# EAGLE design stm32-easy64 (EAGLE 5.11)

## Sheet 1 of 2
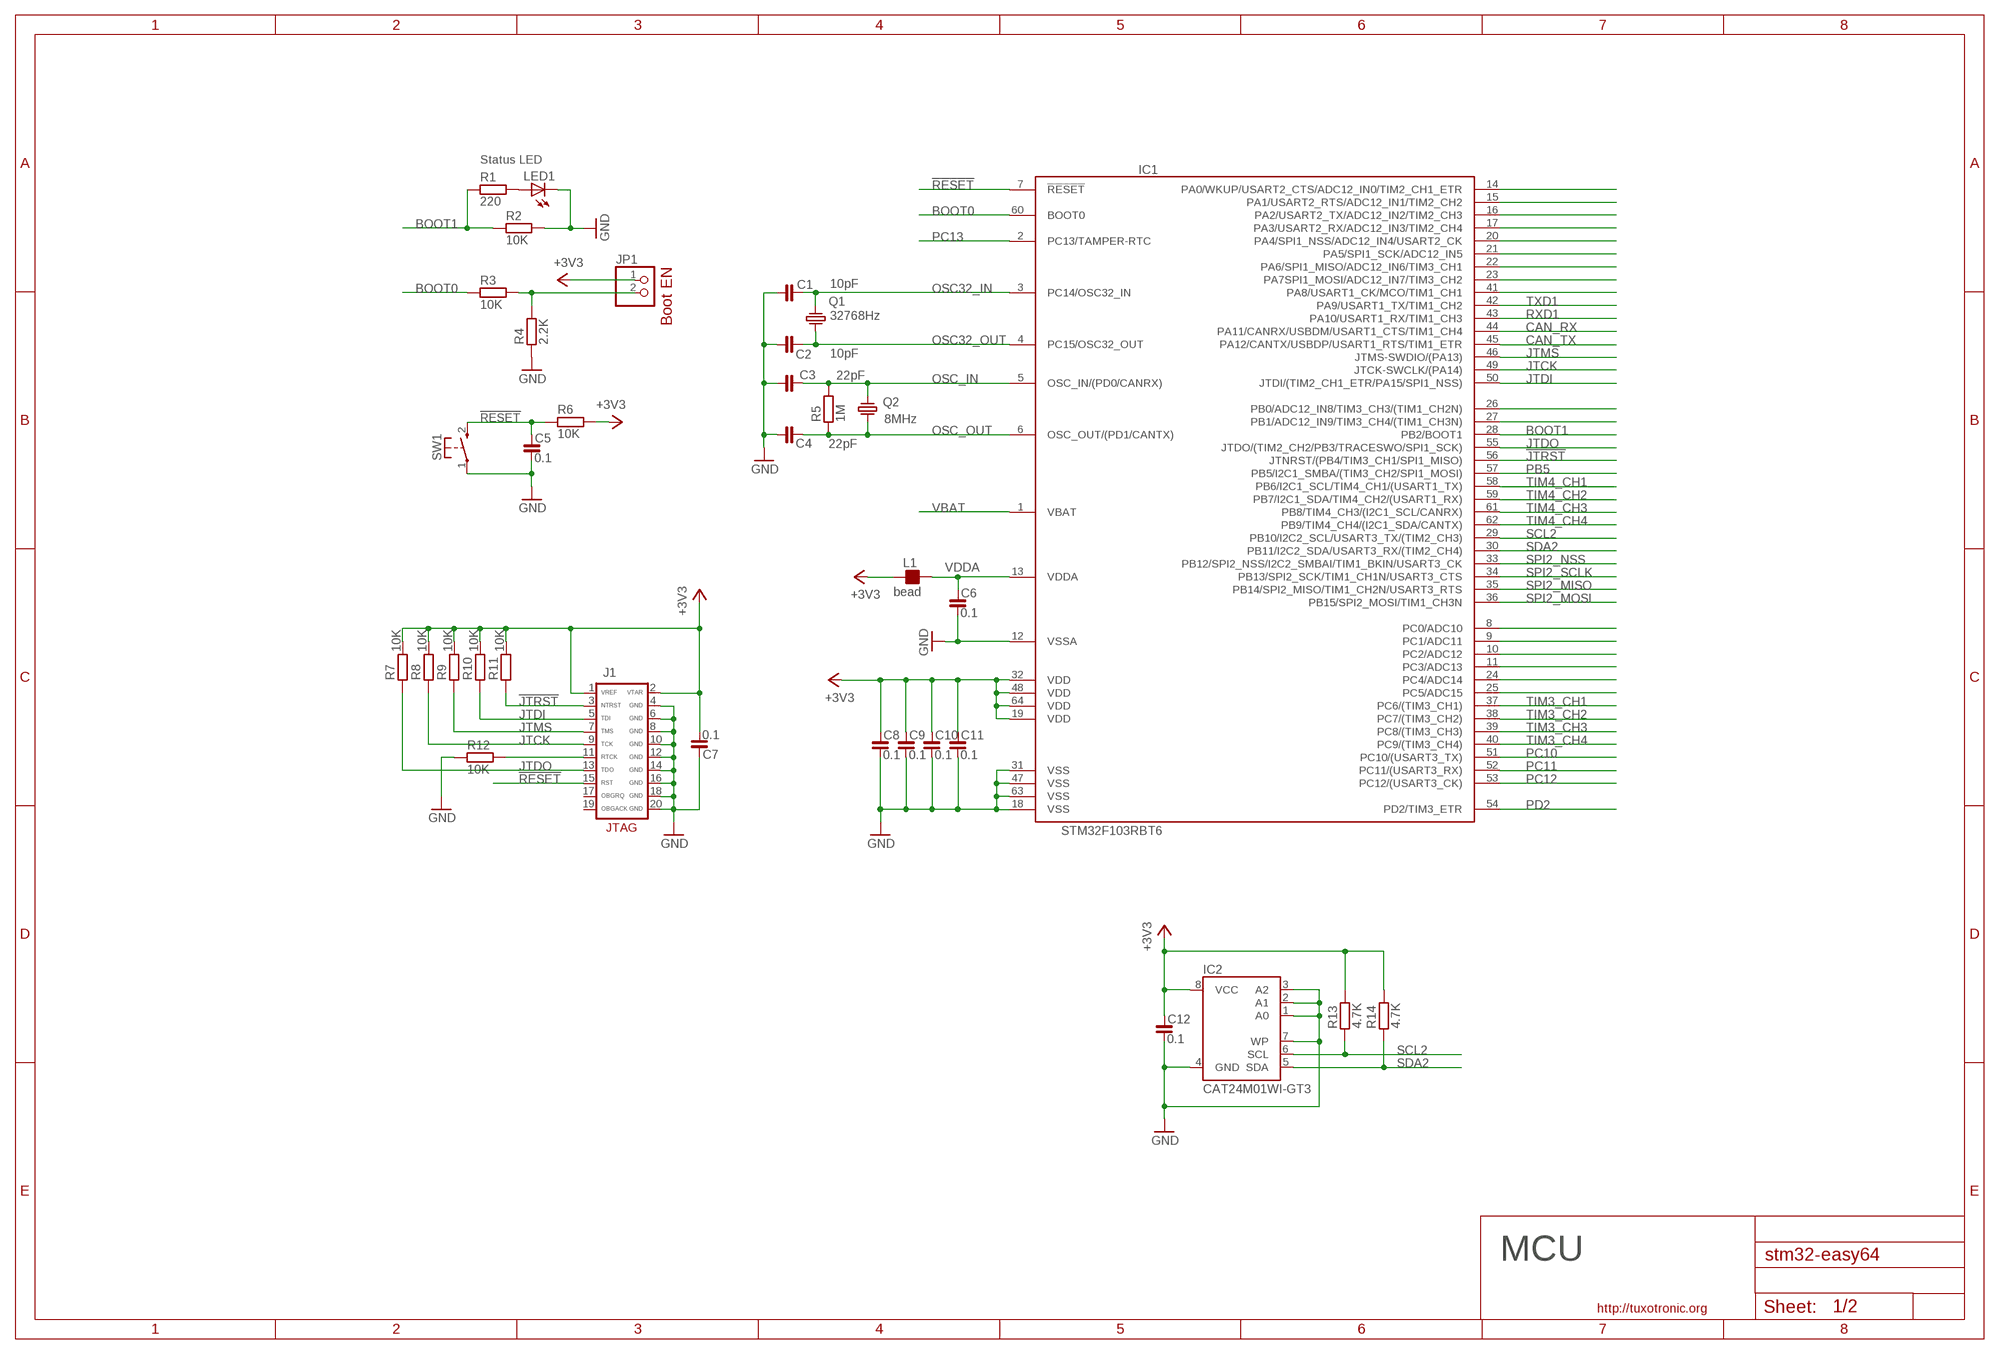
[diagram p0: schematic, sheet 1]

### Parts
C1  10pF  C_0603  [C0603]
C2  10pF  C_0603  [C0603]
C3  22pF  C_0603  [C0603]
C4  22pF  C_0603  [C0603]
C5  0.1  C_0603  [C0603]
C6  0.1  C_0603  [C0603]
C7  0.1  C_0603  [C0603]
C8  0.1  C_0603  [C0603]
C9  0.1  C_0603  [C0603]
C10  0.1  C_0603  [C0603]
C11  0.1  C_0603  [C0603]
C12  0.1  C_0603  [C0603]
IC1  STM32F103RBT6  STM32F103R  [TQFP64]
IC2  CAT24M01WI-GT3  AT24C256S  [SO08]
J1  JTAG-ARM-HDR2MM  [2X10M]
JP1  PINHD-1X2_2.00  [1X02M]
L1  bead  FB_0603  [L0603]
LED1  LEDCHIP-LED0805  [CHIP-LED0805]
Q1  32768Hz  CRYSTAL-TC26H  [TC26H]
Q2  8MHz  CRYSTAL-HC49S  [HC49/S]
R1  220  R_0603  [R0603]
R2  10K  R_0603  [R0603]
R3  10K  R_0603  [R0603]
R4  2.2K  R_0603  [R0603]
R5  1M  R_0603  [R0603]
R6  10K  R_0603  [R0603]
R7  10K  R_0603  [R0603]
R8  10K  R_0603  [R0603]
R9  10K  R_0603  [R0603]
R10  10K  R_0603  [R0603]
R11  10K  R_0603  [R0603]
R12  10K  R_0603  [R0603]
R13  4.7K  R_0603  [R0603]
R14  4.7K  R_0603  [R0603]
SW1  KSS-2EG4430  [KSS-2EG4430]

### Nets
!JTRST: IC1.56(JTNRST/(PB4/TIM3_CH1/SPI1_MISO)) J1.3(NTRST) R11.1
!RESET: C5.1 IC1.7(!RESET) J1.15(RST) R6.1 SW1.2(S)
+3V3: C7.2 C8.1 C9.1 C10.1 C11.1 C12.1 IC1.19(VDD) IC1.32(VDD) IC1.48(VDD) IC1.64(VDD) IC2.8(VCC) J1.1(VREF) J1.2(VTAR) JP1.1 L1.1 R6.2 R7.2 R8.2 R9.2 R10.2 R11.2 R13.2 R14.2 ; also sheet 2
BOOT0: IC1.60(BOOT0) R3.1
BOOT1: IC1.28(PB2/BOOT1) R1.1 R2.1
CAN_RX: IC1.44(PA11/CANRX/USBDM/USART1_CTS/TIM1_CH4) ; also sheet 2
CAN_TX: IC1.45(PA12/CANTX/USBDP/USART1_RTS/TIM1_ETR) ; also sheet 2
GND: C1.2 C2.2 C3.2 C4.2 C5.2 C6.2 C7.1 C8.2 C9.2 C10.2 C11.2 C12.2 IC1.12(VSSA) IC1.18(VSS) IC1.31(VSS) IC1.47(VSS) IC1.63(VSS) IC2.1(A0) IC2.2(A1) IC2.3(A2) IC2.4(GND) IC2.7(WP) J1.4(GND) J1.6(GND) J1.8(GND) J1.10(GND) J1.12(GND) J1.14(GND) J1.16(GND) J1.18(GND) J1.20(GND) LED1.C R2.2 R4.1 R12.1 SW1.1(P) ; also sheet 2
JTCK: IC1.49(JTCK-SWCLK/(PA14)) J1.9(TCK) R8.1
JTDI: IC1.50(JTDI/(TIM2_CH1_ETR/PA15/SPI1_NSS)) J1.5(TDI) R10.1
JTDO: IC1.55(JTDO/(TIM2_CH2/PB3/TRACESWO/SPI1_SCK)) J1.13(TDO) R7.1
JTMS: IC1.46(JTMS-SWDIO/(PA13)) J1.7(TMS) R9.1
N$3: JP1.2 R3.2 R4.2
N$6: J1.11(RTCK) R12.2
N$11: IC1.14(PA0/WKUP/USART2_CTS/ADC12_IN0/TIM2_CH1_ETR)
N$12: IC1.15(PA1/USART2_RTS/ADC12_IN1/TIM2_CH2)
N$13: IC1.16(PA2/USART2_TX/ADC12_IN2/TIM2_CH3)
N$14: IC1.17(PA3/USART2_RX/ADC12_IN3/TIM2_CH4)
N$15: IC1.20(PA4/SPI1_NSS/ADC12_IN4/USART2_CK)
N$16: IC1.21(PA5/SPI1_SCK/ADC12_IN5)
N$17: IC1.22(PA6/SPI1_MISO/ADC12_IN6/TIM3_CH1)
N$18: IC1.23(PA7SPI1_MOSI/ADC12_IN7/TIM3_CH2)
N$19: IC1.41(PA8/USART1_CK/MCO/TIM1_CH1)
N$24: IC1.26(PB0/ADC12_IN8/TIM3_CH3/(TIM1_CH2N))
N$25: IC1.27(PB1/ADC12_IN9/TIM3_CH4/(TIM1_CH3N))
N$30: LED1.A R1.2
N$40: IC1.25(PC5/ADC15)
N$41: IC1.24(PC4/ADC14)
N$42: IC1.11(PC3/ADC13)
N$43: IC1.10(PC2/ADC12)
N$44: IC1.9(PC1/ADC11)
N$45: IC1.8(PC0/ADC10)
OSC32_IN: C1.1 IC1.3(PC14/OSC32_IN) Q1.2
OSC32_OUT: C2.1 IC1.4(PC15/OSC32_OUT) Q1.1
OSC_IN: C3.1 IC1.5(OSC_IN/(PD0/CANRX)) Q2.1 R5.2
OSC_OUT: C4.1 IC1.6(OSC_OUT/(PD1/CANTX)) Q2.2 R5.1
PB5: IC1.57(PB5/I2C1_SMBA/(TIM3_CH2/SPI1_MOSI)) ; also sheet 2
PC10: IC1.51(PC10/(USART3_TX)) ; also sheet 2
PC11: IC1.52(PC11/(USART3_RX)) ; also sheet 2
PC12: IC1.53(PC12/(USART3_CK)) ; also sheet 2
PC13: IC1.2(PC13/TAMPER-RTC)
PD2: IC1.54(PD2/TIM3_ETR) ; also sheet 2
RXD1: IC1.43(PA10/USART1_RX/TIM1_CH3)
SCL2: IC1.29(PB10/I2C2_SCL/USART3_TX/(TIM2_CH3)) IC2.6(SCL) R13.1
SDA2: IC1.30(PB11/I2C2_SDA/USART3_RX/(TIM2_CH4)) IC2.5(SDA) R14.1
SPI2_MISO: IC1.35(PB14/SPI2_MISO/TIM1_CH2N/USART3_RTS)
SPI2_MOSI: IC1.36(PB15/SPI2_MOSI/TIM1_CH3N)
SPI2_NSS: IC1.33(PB12/SPI2_NSS/I2C2_SMBAI/TIM1_BKIN/USART3_CK)
SPI2_SCLK: IC1.34(PB13/SPI2_SCK/TIM1_CH1N/USART3_CTS)
TIM3_CH1: IC1.37(PC6/(TIM3_CH1)) ; also sheet 2
TIM3_CH2: IC1.38(PC7/(TIM3_CH2)) ; also sheet 2
TIM3_CH3: IC1.39(PC8/(TIM3_CH3)) ; also sheet 2
TIM3_CH4: IC1.40(PC9/(TIM3_CH4)) ; also sheet 2
TIM4_CH1: IC1.58(PB6/I2C1_SCL/TIM4_CH1/(USART1_TX)) ; also sheet 2
TIM4_CH2: IC1.59(PB7/I2C1_SDA/TIM4_CH2/(USART1_RX)) ; also sheet 2
TIM4_CH3: IC1.61(PB8/TIM4_CH3/(I2C1_SCL/CANRX)) ; also sheet 2
TIM4_CH4: IC1.62(PB9/TIM4_CH4/(I2C1_SDA/CANTX)) ; also sheet 2
TXD1: IC1.42(PA9/USART1_TX/TIM1_CH2)
VBAT: IC1.1(VBAT)
VDDA: C6.1 IC1.13(VDDA) L1.2
Unconnected: J1.17(OBGRQ) J1.19(OBGACK)

### Notes on the sheet
- Status LED
- Boot EN
- MCU

## Sheet 2 of 2
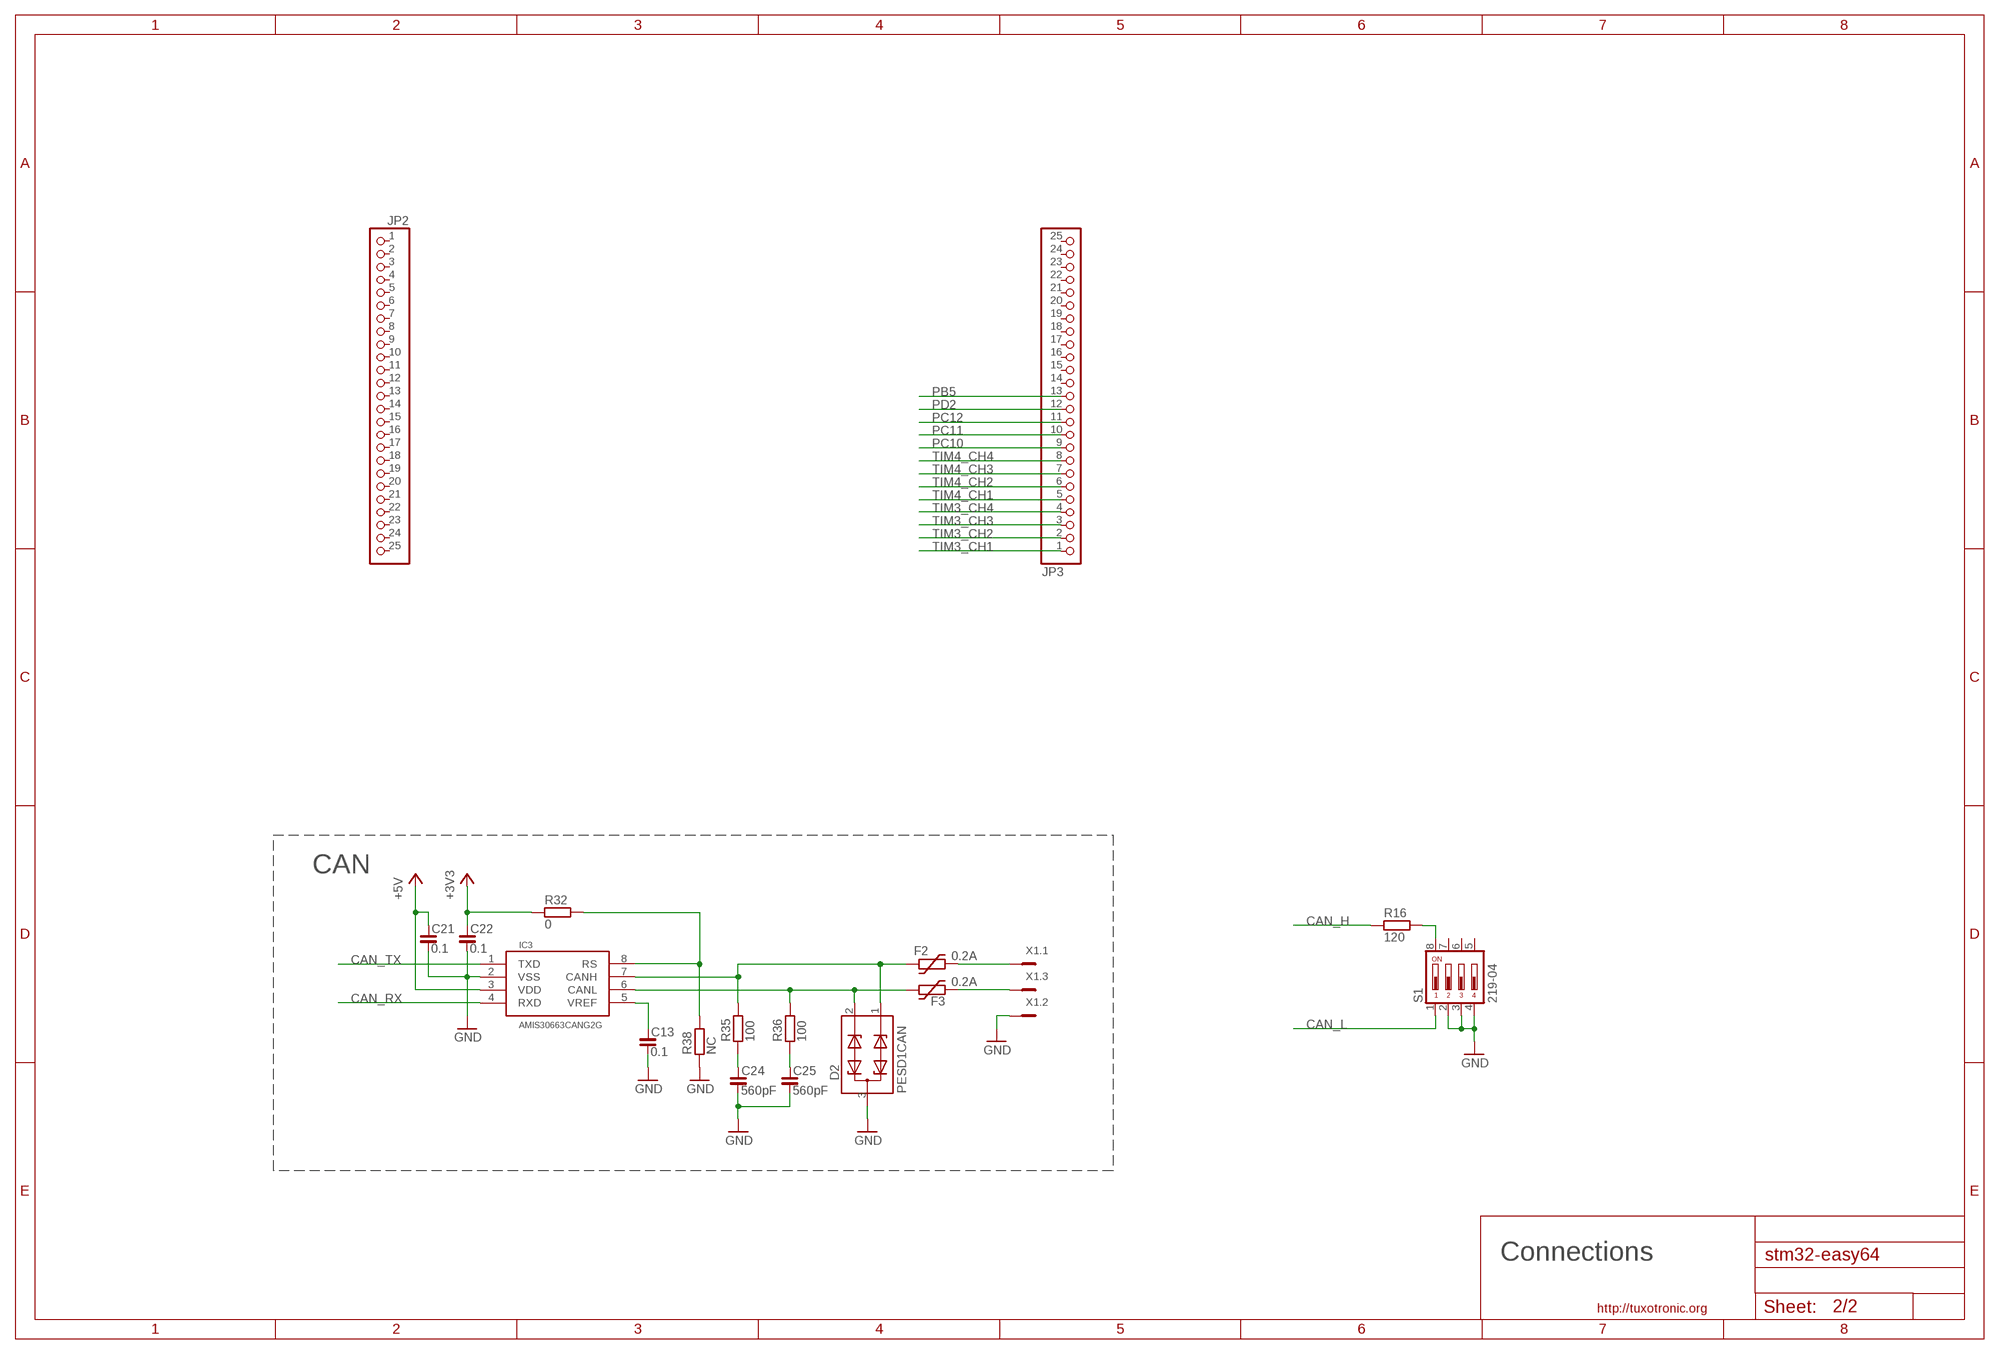
[diagram p1: schematic, sheet 2]

### Parts
C13  0.1  C_0603  [C0603]
C21  0.1  C_0603  [C0603]
C22  0.1  C_0603  [C0603]
C24  560pF  C_0603  [C0603]
C25  560pF  C_0603  [C0603]
D2  PESD1CAN  [SOT23]
F2  0.2A  1812L  [1812L]
F3  0.2A  1812L  [1812L]
IC3  AMIS30663CANG2G  SN65HVD230  [SO08]
JP2  PINHD-1X25_2.00  [1X25M]
JP3  PINHD-1X25_2.00  [1X25M]
R16  120  R_0805  [R0805]
R32  0  R_0603  [R0603]
R35  100  R_0603  [R0603]
R36  100  R_0603  [R0603]
R38  NC  R_0603  [R0603]
S1  219-04  [CTS-219-04]
X1  MCV3  [MCV3]

### Nets
+3V3: C22.1 R32.1 ; also sheet 1
+5V: C21.1 IC3.3(VDD)
CAN_CTRL: IC3.8(RS) R32.2 R38.2
CAN_H: F2.P$2 R16.1 X1.1
CAN_L: F3.P$2 S1.1 X1.3
CAN_RX: IC3.4(RXD) ; also sheet 1
CAN_TX: IC3.1(TXD) ; also sheet 1
GND: C13.2 C21.2 C22.2 C24.2 C25.2 D2.3 IC3.2(VSS) R38.1 S1.2 S1.3 S1.4 X1.2 ; also sheet 1
N$1: C13.1 IC3.5(VREF)
N$2: R16.2 S1.8
N$51: D2.1 F2.P$1 IC3.7(CANH) R35.2
N$52: D2.2 F3.P$1 IC3.6(CANL) R36.2
N$54: C25.1 R36.1
N$55: C24.1 R35.1
PB5: JP3.13 ; also sheet 1
PC10: JP3.9 ; also sheet 1
PC11: JP3.10 ; also sheet 1
PC12: JP3.11 ; also sheet 1
PD2: JP3.12 ; also sheet 1
TIM3_CH1: JP3.1 ; also sheet 1
TIM3_CH2: JP3.2 ; also sheet 1
TIM3_CH3: JP3.3 ; also sheet 1
TIM3_CH4: JP3.4 ; also sheet 1
TIM4_CH1: JP3.5 ; also sheet 1
TIM4_CH2: JP3.6 ; also sheet 1
TIM4_CH3: JP3.7 ; also sheet 1
TIM4_CH4: JP3.8 ; also sheet 1
Unconnected: JP2.1 JP2.2 JP2.3 JP2.4 JP2.5 JP2.6 JP2.7 JP2.8 JP2.9 JP2.10 JP2.11 JP2.12 JP2.13 JP2.14 JP2.15 JP2.16 JP2.17 JP2.18 JP2.19 JP2.20 JP2.21 JP2.22 JP2.23 JP2.24 JP2.25 JP3.14 JP3.15 JP3.16 JP3.17 JP3.18 JP3.19 JP3.20 JP3.21 JP3.22 JP3.23 JP3.24 JP3.25 S1.5 S1.6 S1.7

### Notes on the sheet
- CAN
- Connections

## Library data of the parts
C1-C13 C21 C22 C24 C25 = rc-master-smd:C_: NON-POLARIZED CAP
D2 = protect:PESD1CAN: Features Due to the integrated diode structure only one small SOT23 package is needed to protect two CAN bus lines Max. peak pulse power: PPP = 200 W at tp = 8/20 ?s Low clamping voltage: VCL = 40 V at IPP = 1 A Ultra low leakage current: IRM < 1 nA ESD protection up to 23 kV IEC 61000-4-2, level 4 (ESD) IEC 61000-4-5 (surge); IPP = 3 A at tp = 8/20 ?s Small SMD plastic package Applications CAN bus protection Automotive applications
F2 F3 = discrete:1812L
IC1 = stm32:STM32F103R: Medium-density performance line ARM-based 32-bit MCU with 64 or 128 KB Flash, USB, CAN, 7 timers, 2 ADCs, 9 communication interfaces
IC2 = stm32-by-pb:AT24C*: 2-wire serial EEPROM
IC3 = interfaces:SN65HVD230: CAN PHY driver
J1 = atmel-arm:JTAG-ARM-: JTAG Programming/Debug Connector
JP1 = pinhead-fixdrills:PINHD-1X2: PIN HEADER
JP2 JP3 = pinhead-fixdrills:PINHD-1X25: PIN HEADER
L1 = rc-master-smd:FB_: FERRITE BEAD
LED1 = led:LED: LED OSRAM: - CHIPLED LG R971, LG N971, LY N971, LG Q971, LY Q971, LO R971, LY R971 LH N974, LH R974 LS Q976, LO Q976, LY Q976 LO Q996 - Hyper CHIPLED LW Q18S LB Q993, LB Q99A, LB R99A - SideLED LS A670, LO A670, LY A670, LG A670, LP A670 LB A673, LV A673, LT A673, LW A673 LH A674 LY A675 LS A676, LA A676, LO A676, LY A676, LW A676 LS A679, LY A679, LG A679 - Hyper Micro SIDELED® LS Y876, LA Y876, LO Y876, LY Y876 LT Y87S - SmartLED LW L88C, LW L88S LB L89C, LB L89S, LG L890 LS L89K, LO L89K, LY L89K LS L896, LA L896, LO L896, LY L896 - TOPLED LS T670, LO T670, LY T670, LG T670, LP T670 LSG T670, LSP T670, LSY T670, LOP T670, LYG T670 LG T671, LOG T671, LSG T671 LB T673, LV T673, LT T673, LW T673 LH T674 LS T676, LA T676, LO T676, LY T676, LB T676, LH T676, LSB T676, LW T676 LB T67C, LV T67C, LT T67C, LS T67K, LO T67K, LY T67K, LW E67C LS E67B, LA E67B, LO E67B, LY E67B, LB E67C, LV E67C, LT E67C LW T67C LS T679, LY T679, LG T679 LS T770, LO T770, LY T770, LG T770, LP T770 LB T773, LV T773, LT T773, LW T773 LH T774 LS E675, LA E675, LY E675, LS T675 LS T776, LA T776, LO T776, LY T776, LB T776 LHGB T686 LT T68C, LB T68C - Hyper Mini TOPLED® LB M676 - Mini TOPLED Santana® LG M470 LS M47K, LO M47K, LY M47K Source: http://www.osram.convergy.de - LUMILED® LXK2-PW12-R00, LXK2-PW12-S00, LXK2-PW14-U00, LXK2-PW14-V00 LXK2-PM12-R00, LXK2-PM12-S00, LXK2-PM14-U00 LXK2-PE12-Q00, LXK2-PE12-R00, LXK2-PE12-S00, LXK2-PE14-T00, LXK2-PE14-U00 LXK2-PB12-K00, LXK2-PB12-L00, LXK2-PB12-M00, LXK2-PB14-N00, LXK2-PB14-P00, LXK2-PB14-Q00 LXK2-PR12-L00, LXK2-PR12-M00, LXK2-PR14-Q00, LXK2-PR14-R00 LXK2-PD12-Q00, LXK2-PD12-R00, LXK2-PD12-S00 LXK2-PH12-R00, LXK2-PH12-S00 LXK2-PL12-P00, LXK2-PL12-Q00, LXK2-PL12-R00 Source: www.luxeon.com
Q1 Q2 = discrete:CRYSTAL-: CRYSTAL
R1-R14 R16 R32 R35 R36 R38 = rc-master-smd:R_: RESISTOR
S1 = switch-dil:219-04*: Surface Mount DIP Switch Series 219 SMT CTS Electronic Components Sourc: www.ctscorp.com
SW1 = buttons:KSS-2EG4430: Size: 3x6mm Height: 5mm from PCB Rating: DC12v 50mA Travel: 0.25±0.10mm Operating Force: 180±50gf Return Force: 60gf min Contact resistance: 100m? max Insulation resistance: 100M? min Operating life?50,000 cycles
X1 = con-phoenix-381_l:MCV3: Mini-Combicon 3.81mm vertikal 3polig (ohne Gegenstecker)

## Net classes
0 default: width 0.1 mm, drill 0.1 mm, clearance 0.1 mm

## Board
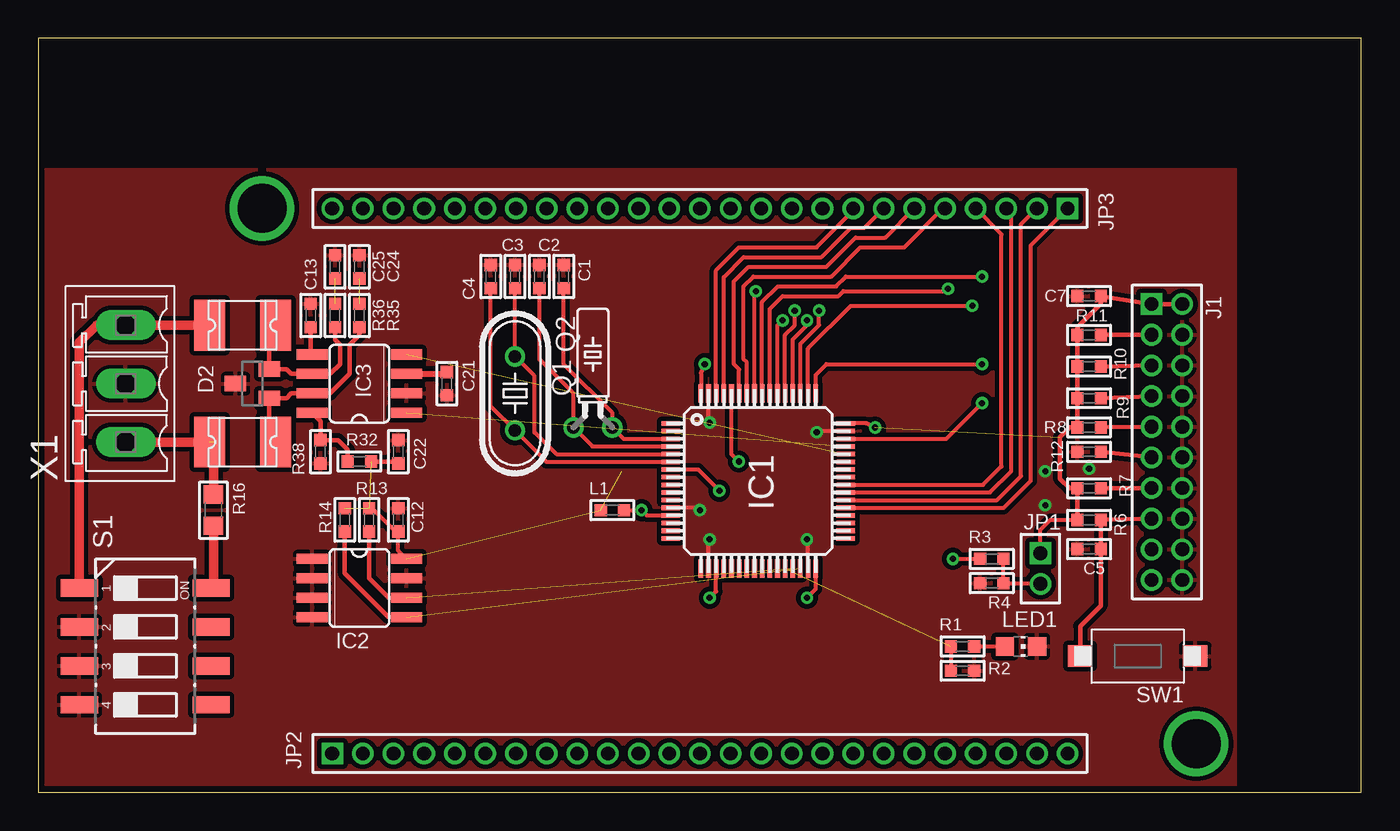
[diagram p2: board, top side]
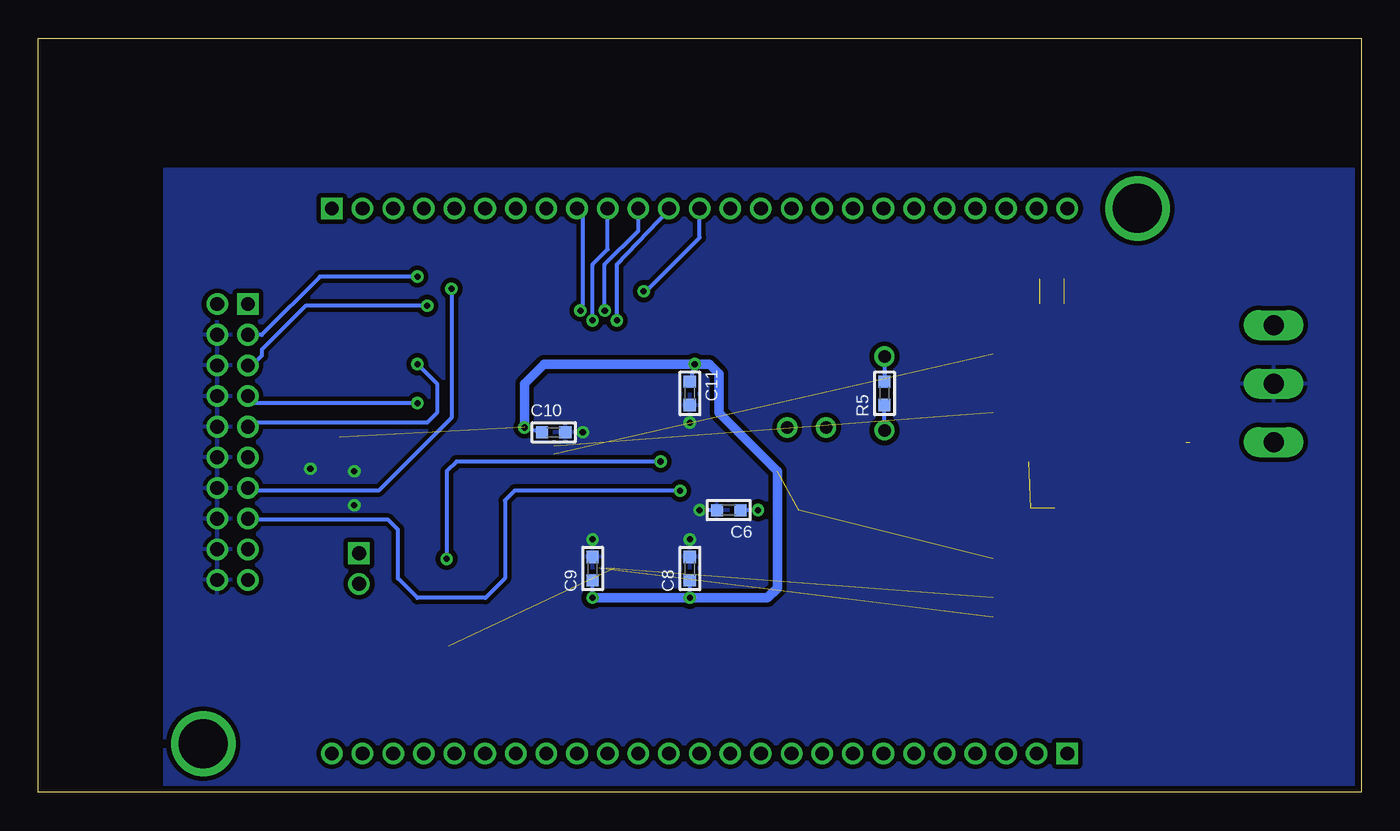
[diagram p3: board, bottom side, seen from below]

Size 86.34 x 49.2 mm. Coordinates in mm from the lower left corner, seen from the top.
Outline: 0,0 86.34,0 86.34,49.2 0,49.2 0,0
Copper layers (1*16): Top 0.035mm / dielectric 1.5mm / Bottom 0.035mm
Design rules "default *": minimum track width 0.16mm, minimum drill 0.4mm, track to track 0.16mm, track to pad 0.16mm, pad to pad 0.16mm, via to via 0.16mm, smd to smd 0.16mm, copper to edge 0.4mm, drill to drill 8mil, minimum pad ring 10mil, minimum via ring 8mil, stop-mask expansion 4mil, vias tented up to drill 0.6mm, thermal gap 10mil

### Footprints (pad centres in the part's own frame; a part is rotated, then mirrored left to right if it is on the bottom)
C0603 = smd 0.8 x 0.8: 1 -0.762,0; 2 0.762,0
SOT23 = smd 1 x 1.4: 1 -0.95,-1.1; 2 0.95,-1.1; 3 0,1.1
1812L = smd 2.03 x 3.3: P$1 -2.16,0; P$2 2.16,0
TQFP64 = smd 1.2 x 0.3: 1 -5.7,3.75; 2 -5.7,3.25; 3 -5.7,2.75; 4 -5.7,2.25; 5 -5.7,1.75; 6 -5.7,1.25; 7 -5.7,0.75; 8 -5.7,0.25; 9 -5.7,-0.25; 10 -5.7,-0.75; 11 -5.7,-1.25; 12 -5.7,-1.75; 13 -5.7,-2.25; 14 -5.7,-2.75; 15 -5.7,-3.25; 16 -5.7,-3.75; 33 5.7,-3.75; 34 5.7,-3.25; 35 5.7,-2.75; 36 5.7,-2.25; 37 5.7,-1.75; 38 5.7,-1.25; 39 5.7,-0.75; 40 5.7,-0.25; 41 5.7,0.25; 42 5.7,0.75; 43 5.7,1.25; 44 5.7,1.75; 45 5.7,2.25; 46 5.7,2.75; 47 5.7,3.25; 48 5.7,3.75 | smd 0.3 x 1.2: 17 -3.75,-5.7; 18 -3.25,-5.7; 19 -2.75,-5.7; 20 -2.25,-5.7; 21 -1.75,-5.7; 22 -1.25,-5.7; 23 -0.75,-5.7; 24 -0.25,-5.7; 25 0.25,-5.7; 26 0.75,-5.7; 27 1.25,-5.7; 28 1.75,-5.7; 29 2.25,-5.7; 30 2.75,-5.7; 31 3.25,-5.7; 32 3.75,-5.7; 49 3.75,5.7; 50 3.25,5.7; 51 2.75,5.7; 52 2.25,5.7; 53 1.75,5.7; 54 1.25,5.7; 55 0.75,5.7; 56 0.25,5.7; 57 -0.25,5.7; 58 -0.75,5.7; 59 -1.25,5.7; 60 -1.75,5.7; 61 -2.25,5.7; 62 -2.75,5.7; 63 -3.25,5.7; 64 -3.75,5.7
SO08 = smd 0.66 x 2.032: 1 -1.905,-3.073; 2 -0.635,-3.073; 3 0.635,-3.073; 4 1.905,-3.073; 5 1.905,3.073; 6 0.635,3.073; 7 -0.635,3.073; 8 -1.905,3.073
2X10M = drill 0.9 square: 1 -9,-1 | drill 0.9 round: 2 -9,1; 3 -7,-1; 4 -7,1; 5 -5,-1; 6 -5,1; 7 -3,-1; 8 -3,1; 9 -1,-1; 10 -1,1; 11 1,-1; 12 1,1; 13 3,-1; 14 3,1; 15 5,-1; 16 5,1; 17 7,-1; 18 7,1; 19 9,-1; 20 9,1
1X02M = drill 0.9 square: 1 -1,0 | drill 0.9 round: 2 1,0
1X25M = drill 0.9 square: 1 -24,0 | drill 0.9 round: 2 -22,0; 3 -20,0; 4 -18,0; 5 -16,0; 6 -14,0; 7 -12,0; 8 -10,0; 9 -8,0; 10 -6,0; 11 -4,0; 12 -2,0; 13 0,0; 14 2,0; 15 4,0; 16 6,0; 17 8,0; 18 10,0; 19 12,0; 20 14,0; 21 16,0; 22 18,0; 23 20,0; 24 22,0; 25 24,0
L0603 = smd 0.8 x 0.8: 1 -0.762,0; 2 0.762,0
CHIP-LED0805 = smd 1.2 x 1.2: A 0,-1.05; C 0,1.05
TC26H = drill 0.813 round: 1 -1.27,0; 2 1.27,0
HC49/S = drill 0.813 round: 1 -2.413,0; 2 2.413,0
R0603 = smd 0.8 x 0.8: 1 -0.762,0; 2 0.762,0
R0805 = smd 1.2 x 1.3: 1 -1.016,0; 2 1.016,0
CTS-219-04 = smd 1.13 x 2.44: 1 -3.81,-4.3; 2 -1.27,-4.3; 3 1.27,-4.3; 4 3.81,-4.3; 5 3.81,4.3; 6 1.27,4.3; 7 -1.27,4.3; 8 -3.81,4.3
KSS-2EG4430 = smd 1.6 x 1.4: 1 -3.75,0; 2 3.75,0
MCV3 = drill 1.3 pad 1.905 long: 1 -3.81,0; 2 0,0; 3 3.81,0

### Placement (x,y rotation side)
C1  34.29,33.66 90 top
C2  32.7,33.66 90 top
C3  31.11,33.66 90 top
C4  29.53,33.66 90 top
C5  68.58,15.88 180 top
C6  41.27,18.41 180 bottom
C7  68.58,32.38 0 top
C8  43.81,14.61 90 bottom
C9  50.16,14.61 90 bottom
C10  52.7,23.5 0 bottom
C11  43.81,26.04 270 bottom
C12  23.5,17.78 90 top
C13  17.78,31.11 90 top
C21  26.67,26.67 270 top
C22  23.5,22.23 90 top
C24  20.95,34.29 90 top
C25  19.37,34.29 90 top
D2  13.97,26.67 90 top
F2  13.34,22.86 180 top
F3  13.34,30.48 180 top
IC1  46.99,20.32 0 top
IC2  20.95,13.34 270 top
IC3  20.95,26.67 90 top
J1  73.66,22.86 270 top
JP1  65.41,14.61 270 top
JP2  43.18,2.54 0 top
JP3  43.18,38.1 180 top
L1  37.47,18.41 0 top
LED1  64.14,9.53 270 top
Q1  36.2,23.81 0 top
Q2  31.11,26.04 270 top
R1  60.33,9.53 0 top
R2  60.33,7.94 0 top
R3  62.23,15.24 0 top
R4  62.23,13.65 0 top
R5  31.11,26.04 90 bottom
R6  68.58,17.78 180 top
R7  68.58,19.84 180 top
R8  68.58,23.81 180 top
R9  68.58,25.72 180 top
R10  68.58,27.78 180 top
R11  68.58,29.84 180 top
R12  68.58,22.23 0 top
R13  21.59,17.78 90 top
R14  20,17.78 90 top
R16  11.43,18.41 270 top
R32  20.95,21.59 180 top
R35  20.95,31.11 270 top
R36  19.37,31.11 270 top
R38  18.41,22.23 90 top
S1  6.99,9.53 270 top
SW1  71.75,8.89 180 top
X1  5.71,26.67 90 top

### Tracks (layer width: path | path; a pad name or v marks a point on that pad's centre or on a via)
!JTRST  (via drill 0.4)
  Top 0.254: v61.59,33.66 52.7,33.66 52.07,33.02 48.26,33.02 47.24,32 IC1.56
  Top 0.305: J1.3 R11.1
  Bottom 0.254: v61.59,33.66 67.96,33.66 71.75,29.86 J1.3
!RESET  (via drill 0.4)
  Top 0.254: IC1.7 43.06,21.07 v44.45,19.68
  Top 0.305: J1.15 R6.1 C5.1 69.34,12.19 68,10.86 SW1.2
  Bottom 0.254: v44.45,19.68 55.24,19.68 55.88,19.05 55.88,13.97 57.15,12.7 61.59,12.7 62.87,13.97 62.87,17.14 63.5,17.78 72.58,17.78 J1.15
+3V3  (via drill 0.4)  (5 unrouted)
  Top 0.254: IC1.64 43.24,27.36 v43.5,27.94 | IC1.19 44.24,13.12 v43.81,12.7 | IC1.32 50.74,13.28 v50.16,12.7 | IC1.48 54.03,24.07 v54.61,23.81 | R13.2 21.78,18.54 23.3,17.02 C12.1 23.5,15.77 IC2.8 | JP1.1 65.41,17.14 66.04,17.78 R6.2
  Top 0.305: J1.2 J1.1 C7.2 69.34,31.88 67.82,30.35 R11.2 R10.2 R9.2 R8.2 67.31,23.81 66.67,23.18 66.67,20.48 67.31,19.84 R7.2 R6.2 | R32.1 23.37,21.59 C22.1
  Bottom 0.254: v43.5,27.94 C11.1 | v43.81,12.7 C8.1 | v50.16,12.7 C9.1 | v54.61,23.81 C10.1
  Bottom 0.61: v54.61,23.81 54.61,26.67 53.34,27.94 v43.5,27.94 42.55,27.94 41.91,27.3 41.91,24.77 38.1,20.95 38.1,13.34 38.73,12.7 v43.81,12.7 v50.16,12.7
+5V
  Top 0.406: IC3.3 26.67,27.3 C21.1
BOOT0  (via drill 0.4)
  Top 0.254: IC1.60 45.24,22.07 v45.72,21.59 | v59.69,15.24 R3.1
  Bottom 0.254: v45.72,21.59 59.05,21.59 59.69,20.95 v59.69,15.24
BOOT1  (1 unrouted)
  Top 0.254: R1.1 R2.1
CAN_CTRL
  Top 0.305: IC3.8 18.41,24.23 R38.2 19.56,22.99 20.19,22.35 R32.2
CAN_H  (1 unrouted)
  Top 0.61: X1.1 11.43,22.86 R16.1
CAN_L
  Top 0.61: F3.P$2 X1.3 3.81,30.48 2.69,29.36 S1.1
CAN_RX  (1 unrouted)
CAN_TX  (1 unrouted)
GND  (via drill 0.4)
  Top 0.254: IC1.31 50.24,16.43 v50.16,16.51 | IC1.47 50.88,23.57 v50.8,23.5 | IC1.63 43.74,24.2 v43.81,24.13 | IC1.18 43.74,16.43 v43.81,16.51 | IC1.12 43.02,18.57 v43.18,18.41
  Bottom 0.254: C6.2 v43.18,18.41
  other vias: 68.58,21.11 65.72,20.95 65.72,18.73
  pour Top (isolate 0.305): 78.11,0 0,0 0,40.64 78.11,40.64
  pour Bottom (isolate 0.305): 78.11,0 0,0 0,40.64 78.11,40.64
JTCK  (via drill 0.4)
  Top 0.254: IC1.49 50.74,27.25 51.44,27.94 v61.59,27.94
  Top 0.305: J1.9 R8.1
  Bottom 0.254: 72.65,23.85 J1.9 72.39,24.13 60.96,24.13 60.33,24.77 60.33,26.67 v61.59,27.94
JTDI  (via drill 0.4)
  Top 0.254: IC1.50 50.24,28.97 53.02,31.75 v60.96,31.75
  Top 0.305: J1.5 R10.1
  Bottom 0.254: v60.96,31.75 68.9,31.75 71.75,28.89 71.75,28.49 72.39,27.85 J1.5
JTDO  (via drill 0.4)
  Top 0.254: v59.37,32.86 59.21,32.7 52.55,32.7 52.23,32.38 48.58,32.38 47.74,31.55 IC1.55
  Top 0.305: J1.13 R7.1
  Bottom 0.254: v59.37,32.86 59.37,24.45 64.14,19.68 72.48,19.68 J1.13
JTMS  (via drill 0.4)
  Top 0.254: IC1.46 59.27,23.07 v61.59,25.4
  Top 0.305: J1.7 R9.1
  Bottom 0.254: v61.59,25.4 72.2,25.4 J1.7
N$1
  Top 0.305: C13.1 17.78,28.68 IC3.5
N$2
  Top 0.61: R16.2 11.43,13.48 S1.8
N$3
  Top 0.254: JP1.2 65.36,13.65 R4.2 R3.2
N$4  (via drill 3.2)
  other vias: 14.61,38.1
N$5  (via drill 3.2)
  other vias: 75.56,3.17
N$6
  Top 0.305: R12.2 J1.11
N$30
  Top 0.254: R1.2 LED1.A
N$51
  Top 0.305: F2.P$1 15.07,23.29 D2.1 16.2,25.72 16.51,26.04 IC3.7 19.05,26.04 20.32,27.3 20.32,29.21 20.95,29.84 R35.2
N$52
  Top 0.305: F3.P$1 15.07,30.05 D2.2 16.2,27.62 16.51,27.3 IC3.6 19.05,27.3 19.68,27.94 19.68,29.21 19.37,29.53 R36.2
N$54  (1 unrouted)
N$55  (1 unrouted)
OSC32_IN
  Top 0.254: IC1.3 38.21,23.07 Q1.2 37.47,24.77 34.29,27.94 C1.1
OSC32_OUT
  Top 0.254: IC1.4 36.17,22.57 Q1.1 34.92,26.04 32.7,28.26 C2.1
OSC_IN
  Top 0.254: IC1.5 33.81,22.07 32.38,23.5 32.38,27.18 Q2.1 C3.1
  Bottom 0.254: Q2.1 R5.2
OSC_OUT
  Top 0.254: IC1.6 33.17,21.57 Q2.2 29.53,25.21 C4.1
  Bottom 0.254: Q2.2 R5.1
PB5  (via drill 0.4)
  Top 0.254: IC1.57 46.74,32.61 v46.83,32.7
  Bottom 0.254: v46.83,32.7 46.83,32.54 43.18,36.2 JP3.13
PC10  (via drill 0.4)
  Top 0.254: IC1.51 49.74,29.26 50.96,30.48 v50.96,31.43
  Bottom 0.254: v50.96,31.43 50.8,31.59 50.8,37.72 JP3.9
PC11  (via drill 0.4)
  Top 0.254: IC1.52 49.24,29.55 50.16,30.48 v50.16,30.8
  Bottom 0.254: v50.16,30.8 50.16,34.45 49.18,35.43 JP3.10
PC12  (via drill 0.4)
  Top 0.254: IC1.53 48.74,29.85 49.37,30.48 v49.37,31.43
  Bottom 0.254: v49.37,31.43 49.37,34.45 47.18,36.64 JP3.11
PD2  (via drill 0.4)
  Top 0.254: IC1.54 48.24,30.46 v48.58,30.8
  Bottom 0.254: v48.58,30.8 48.58,34.45 45.18,38.01 JP3.12
SCL2  (1 unrouted)
  Top 0.305: R13.1 21.59,13.97 22.86,12.7 IC2.6
SDA2  (1 unrouted)
  Top 0.305: R14.1 20,14.29 22.86,11.43 IC2.5
TIM3_CH1
  Top 0.254: IC1.37 63.02,18.57 64.77,20.32 64.77,35.69 JP3.1
TIM3_CH2
  Top 0.254: IC1.38 62.57,19.07 64.14,20.64 64.14,37.05 JP3.2
TIM3_CH3
  Top 0.254: IC1.39 62.12,19.57 63.5,20.95 63.5,37.78 JP3.3
TIM3_CH4
  Top 0.254: IC1.40 61.66,20.07 62.87,21.27 62.87,36.41 JP3.4
TIM4_CH1
  Top 0.254: JP3.5 59.05,38.1 56.52,35.56 53.66,35.56 51.75,33.66 46.67,33.66 46.04,33.02 46.04,28.26 46.24,28.05 IC1.58
TIM4_CH2
  Top 0.254: JP3.6 55.27,36.2 53.34,36.2 51.44,34.29 46.35,34.29 45.4,33.34 45.4,27.94 45.74,27.6 IC1.59
TIM4_CH3
  Top 0.254: IC1.61 44.74,33.63 46.04,34.92 51.12,34.92 53.02,36.83 53.91,36.83 JP3.7
TIM4_CH4
  Top 0.254: IC1.62 44.24,34.08 45.72,35.56 50.8,35.56 53.18,37.94 JP3.8
VDDA  (via drill 0.4)
  Top 0.254: IC1.13 39.72,18.07 v39.37,18.41 L1.2
  Bottom 0.254: v39.37,18.41 C6.1